# EAGLE design Vanta-Black v4 (EAGLE 9.6.2)
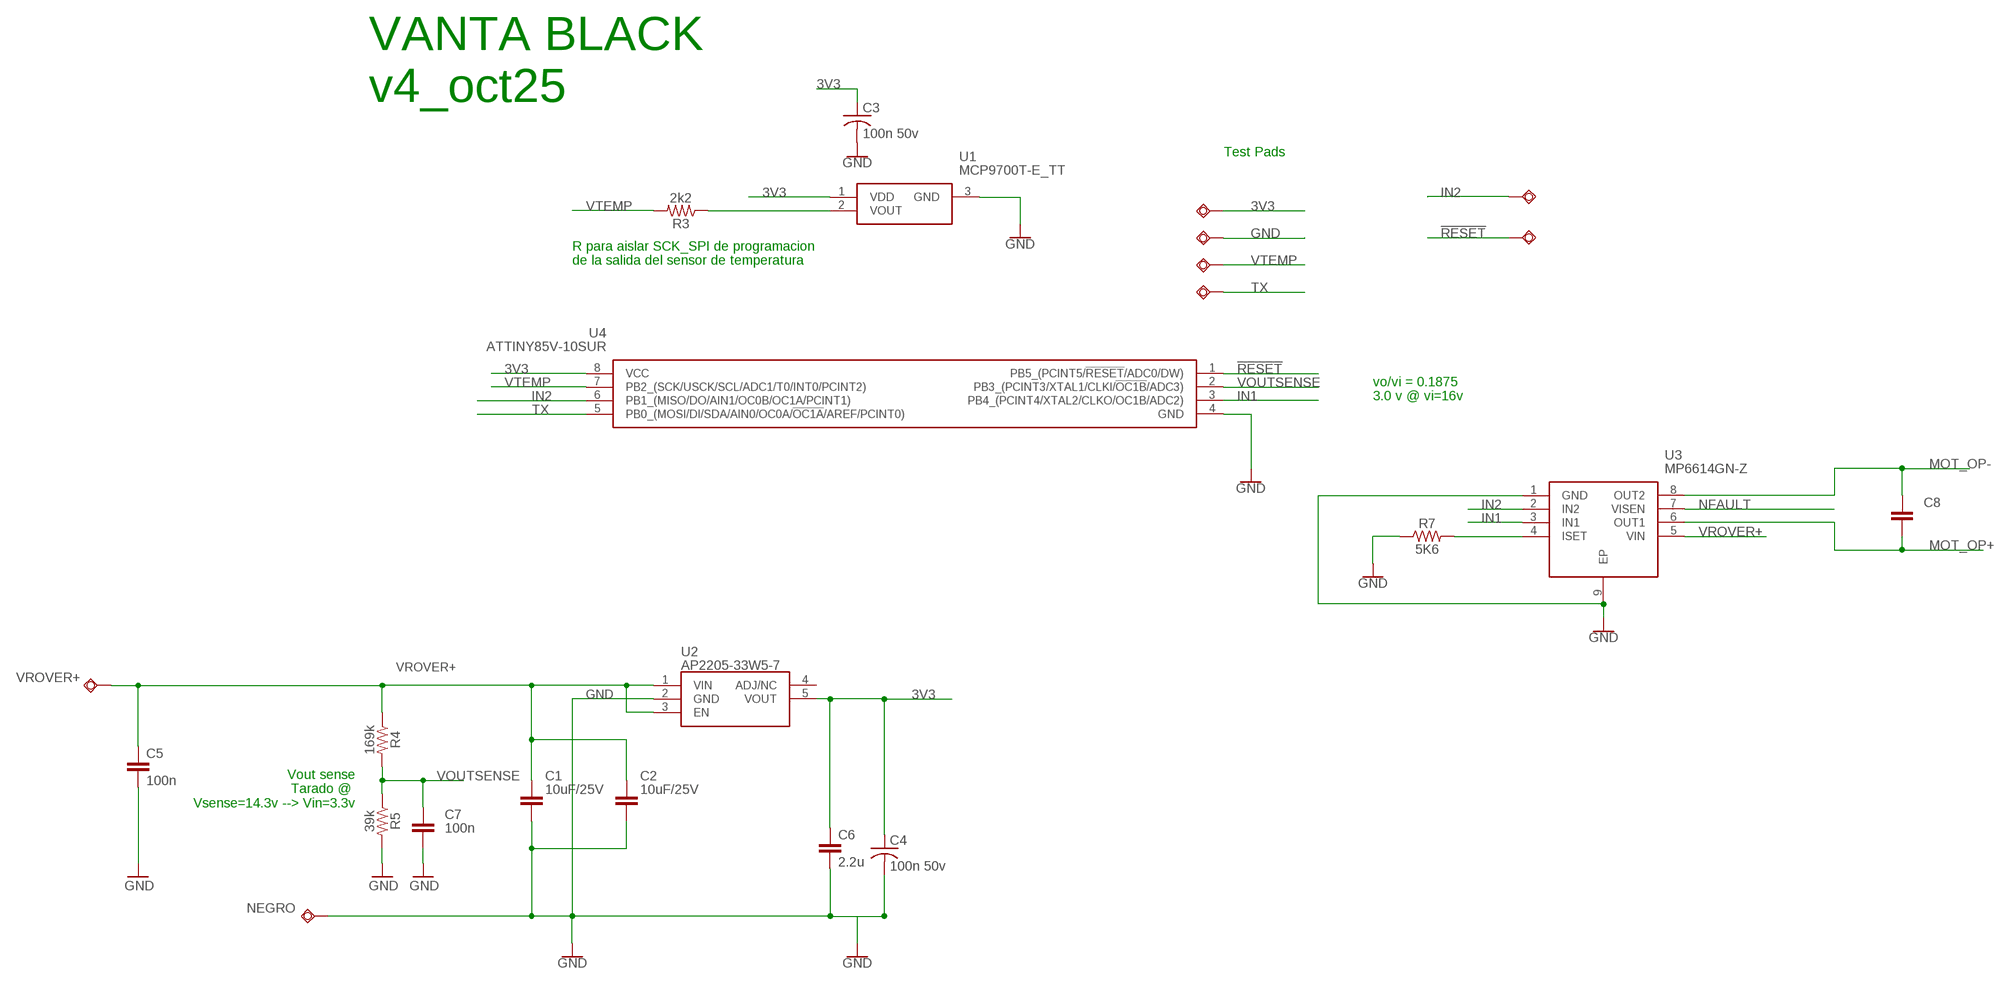
[diagram p0: schematic, sheet 1]

## Parts
3V3  TESTPAD_TPSQB1,27  [TESTPAD_B1,27]
!RST  TESTPAD_TPSQB1,27  [TESTPAD_B1,27]
C1  10uF/25V  C_CHIP-0805(2012-METRIC)  [CAPC2012X110]
C2  10uF/25V  C_CHIP-0805(2012-METRIC)  [CAPC2012X110]
C3  100n 50v  C-USC0805  [C0805]
C4  100n 50v  C-USC0805  [C0805]
C5  100n  4.7UF-6.3V-10%(0603)0603  [0603-CAP]
C6  2.2u  4.7UF-6.3V-10%(0603)0603  [0603-CAP]
C7  100n  0.1UF-0603-25V-(+80/-20%)  [0603]
C8  100n  CAP0805  [0805]
GND  TESTPAD_TPSQB1,27  [TESTPAD_B1,27]
IN2  TESTPAD_TPSQB1,27  [TESTPAD_B1,27]
NEGRO  TESTPAD_TPSQTP10SQ  [TESTPAD_TP10SQ]
R3  2k2  RESISTOR0603  [0603]
R4  169k  RESISTOR0603  [0603]
R5  39k  RESISTOR0603  [0603]
R7  5K6  RESISTOR0603  [0603]
TX  TESTPAD_TPSQB1,27  [TESTPAD_B1,27]
U1  MCP9700T-E_TT  [SOT95P237X112-3N]
U2  AP2205-33W5-7  AP2205-W5-7  [SOT95P282X145-5N]
U3  MP6614GN-Z  [SOIC127P600X170-9N]
U4  ATTINY85V-10SUR  [SOIC127P798X216-8N]
VISEN  TESTPAD_TPSQB1,27  [TESTPAD_B1,27]
VROVER+  TESTPAD_TPSQTP10SQ  [TESTPAD_TP10SQ]

## Nets
3V3: 3V3.TP C3.1 C4.1 C6.1 U1.1(VDD) U2.5(VOUT) U4.8(VCC)
!RESET: !RST.TP U4.1(PB5_(PCINT5/!RESET!/ADC0/DW))
GND: C1.2 C2.2 C3.2 C4.2 C5.2 C6.2 C7.2 GND.TP NEGRO.TP R5.2 R7.1 U1.3(GND) U2.2(GND) U3.1(GND) U3.9(EP) U4.4(GND)
IN1: U3.3(IN1) U4.3(PB4_(PCINT4/XTAL2/CLKO/OC1B/ADC2))
IN2: IN2.TP U3.2(IN2) U4.6(PB1_(MISO/DO/AIN1/OC0B/OC1A/PCINT1))
MOT_OP+: C8.2 U3.6(OUT1)
MOT_OP-: C8.1 U3.8(OUT2)
N$1: R3.1 U1.2(VOUT)
N$2: R7.2 U3.4(ISET)
NFAULT: U3.7(VISEN)
TX: TX.TP U4.5(PB0_(MOSI/DI/SDA/AIN0/OC0A/!OC1A!/AREF/PCINT0))
VOUTSENSE: C7.1 R4.2 R5.1 U4.2(PB3_(PCINT3/XTAL1/CLKI/!OC1B!/ADC3))
VROVER+: C1.1 C2.1 C5.1 R4.1 U2.1(VIN) U2.3(EN) U3.5(VIN) VROVER+.TP
VTEMP: R3.2 U4.7(PB2_(SCK/USCK/SCL/ADC1/T0/INT0/PCINT2)) VISEN.TP
Unconnected: U2.4(ADJ/NC)

## Notes on the sheet
- VANTA BLACK
  v4_oct25
- Test Pads
- R para aislar SCK_SPI de programacion
  de la salida del sensor de temperatura
- vo/vi = 0.1875
  3.0 v @ vi=16v
- Vout sense
  Tarado @ 
  Vsense=14.3v --> Vin=3.3v

## Library data of the parts
3V3 !RST GND IN2 NEGRO TX VISEN VROVER+ = BeagleBone_Blue_R3:TESTPAD_TPSQ: Test pad
C1 C2 = Capacitor:C: Capacitor - Generic; CATEGORY: Capacitor
C3 C4 = adafruit:C-US: CAPACITOR, American symbol
C5 C6 = SparkFun-Capacitors:4.7UF-6.3V-10%(0603): CAP-08280; PROD_ID: CAP-08280; VALUE: 4.7uF
C7 = SparkFun-Capacitors:0.1UF: 0.1µF ceramic capacitors A capacitor is a passive two-terminal electrical component used to store electrical energy temporarily in an electric field.; PROD_ID: CAP-00810; VALUE: 0.1uF
C8 = SparkFun-Passives:CAP: Capacitor Standard 0603 ceramic capacitor, and 0.1" leaded capacitor.
R3-R5 R7 = SparkFun-Resistors:RESISTOR: Generic Resistor Package
U1 = SamacSys_Parts:MCP9700T-E_TT: Linear Active Thermistor 10mV/C SOT23 Source: Datasheet <https://datasheet.datasheetarchive.com/originals/distributors/Datasheets-DGA2/179941.pdf>; ARROW_PART_NUMBER: MCP9700T-E/TT; ARROW_PRICE-STOCK: https://www.arrow.com/en/products/mcp9700t-ett/microchip-technology?utm_currency=USD&region=nac; DESCRIPTION: Linear Active Thermistor 10mV/C SOT23; HEIGHT: 1.12mm; MANUFACTURER_NAME: Microchip; MANUFACTURER_PART_NUMBER: MCP9700T-E/TT; MOUSER_PART_NUMBER: 579-MCP9700T-E/TT; MOUSER_PRICE-STOCK: https://www.mouser.co.uk/ProductDetail/Microchip-Technology/MCP9700T-E-TT?qs=QVBMgXxBiLyzQ04uBGj3mg%3D%3D
U2 = AP2205-W5-7:AP2205-W5-7: LDO Voltage Regulators LDO CMOS LowCurr Source: Datasheet <https://www.diodes.com/assets/Datasheets/AP2206.pdf>; DESCRIPTION: LDO Voltage Regulators LDO CMOS LowCurr; HEIGHT: 1.45mm; MANUFACTURER_NAME: Diodes Inc.; MANUFACTURER_PART_NUMBER: AP2205-W5-7; MOUSER_PART_NUMBER: 621-AP2205-W5-7; MOUSER_PRICE-STOCK: https://www.mouser.com/Search/Refine.aspx?Keyword=621-AP2205-W5-7
U3 = SamacSys_Parts:MP6614GN-Z: Motor/Motion/Ignition Controllers & Drivers 35V, H-Bridge DC Motor Driver in an SOIC-8EP Package Source: Datasheet <https://www.mouser.com/datasheet/2/277/MP6614GN-3364211.pdf>; DESCRIPTION: Motor/Motion/Ignition Controllers & Drivers 35V, H-Bridge DC Motor Driver in an SOIC-8EP Package; HEIGHT: 1.7mm; MANUFACTURER_NAME: Monolithic Power Systems (MPS); MANUFACTURER_PART_NUMBER: MP6614GN-Z; MOUSER_PART_NUMBER: 946-MP6614GN-Z; MOUSER_PRICE-STOCK: https://www.mouser.co.uk/ProductDetail/Monolithic-Power-Systems-MPS/MP6614GN-Z?qs=1Kr7Jg1SGW9IVALEk2ju9A%3D%3D
U4 = SamacSys_Parts:ATTINY85V-10SUR: MICROCHIP - ATTINY85V-10SUR - MCU, 8BIT, AVR, 10MHZ, WSOIC-8 Source: Datasheet <https://componentsearchengine.com/Datasheets/2/ATTINY85V-10SUR.pdf>; DESCRIPTION: MICROCHIP - ATTINY85V-10SUR - MCU, 8BIT, AVR, 10MHZ, WSOIC-8; FARNELL2_PART_NUMBER: 2851618RL; FARNELL2_PRICE-STOCK: http://uk.farnell.com/jsp/displayProduct.jsp?sku=2851618RL&action=view; HEIGHT: 2.16mm; MANUFACTURER_NAME: Microchip; MANUFACTURER_PART_NUMBER: ATTINY85V-10SUR

## Board
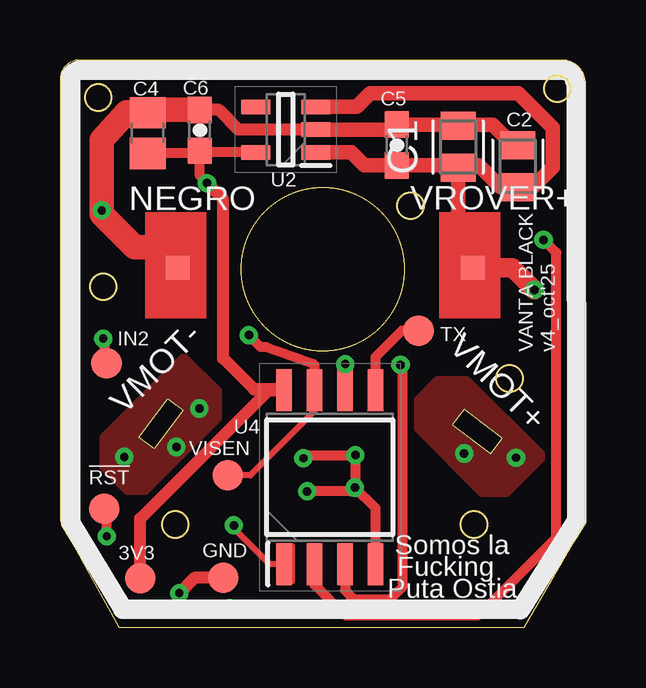
[diagram p1: board, top side]
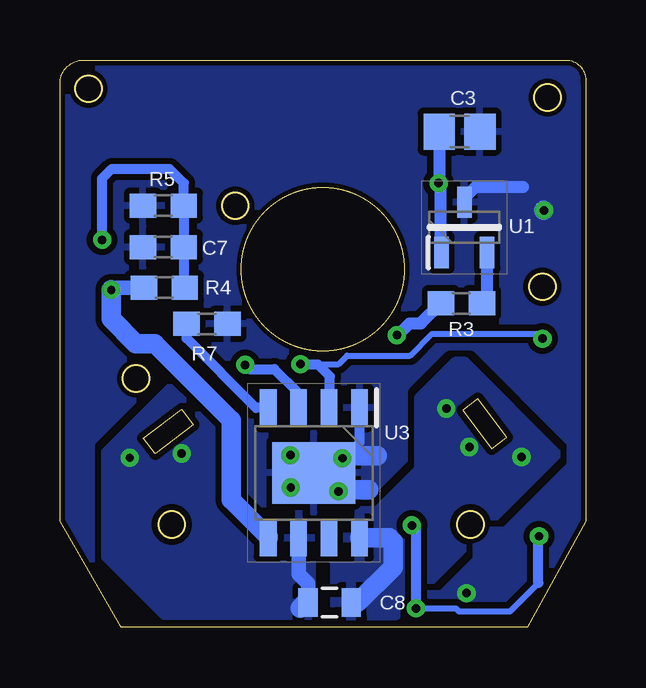
[diagram p2: board, bottom side, seen from below]

Size 21.9 x 23.63 mm. Coordinates in mm from the lower left corner, seen from the top.
Outline: 16.83,9.07 16.35,8.43 17.94,7.22 18.43,7.86 16.83,9.07
Outline: 5.13,9.03 3.92,7.44 3.29,7.92 4.5,9.52 5.13,9.03
Outline: 21.9,22.72 arc90 20.84,23.63 0.74,23.63 arc90 0,22.72 0,4.42 2.44,0 19.35,0 21.9,4.42 21.9,22.72
Outline: circle at 10.95,14.91 radius 3.4
Outline: circle at 4.8,4.28 radius 0.55
Outline: circle at 17.25,4.28 radius 0.55
Outline: circle at 1.8,14.19 radius 0.55
Outline: circle at 18.73,10.36 radius 0.55
Outline: circle at 14.61,17.56 radius 0.55
Outline: circle at 1.59,22.07 radius 0.55
Outline: circle at 20.71,22.43 radius 0.55
Copper layers (1*16): Top 0.035mm / dielectric 1.5mm / Bottom 0.035mm
Design rules "default *": minimum track width 6mil, minimum drill 0.35mm, track to track 10mil, track to pad 10mil, pad to pad 10mil, via to via 10mil, smd to smd 0mil, copper to edge 1mil, drill to drill 6mil, minimum pad ring 10mil, minimum via ring 8mil, stop-mask expansion 4mil, vias tented up to drill 0mil, thermal gap 10mil
vRestrict: area 95.1,61.7 to 95.7,63

### Footprints (pad centres in the part's own frame; a part is rotated, then mirrored left to right if it is on the bottom)
TESTPAD_B1,27 = smd 1.27 x 1.27: TP 0,0
CAPC2012X110 = smd 1.165 x 1.465: 1 -0.875,0; 2 0.875,0
C0805 = smd 1.3 x 1.5: 1 -0.85,0; 2 0.85,0
0603-CAP = smd 1.1 x 1: 1 -0.85,0; 2 0.85,0
0603 = smd 1.1 x 1: 1 -0.85,0; 2 0.85,0
0805 = smd 0.8 x 1.2: 1 -0.9,0; 2 0.9,0
TESTPAD_TP10SQ = smd 1 x 1: TP 0,0
SOT95P237X112-3N = smd 1.3 x 0.6: 1 -1.05,0.95; 2 -1.05,-0.95; 3 1.05,0
SOT95P282X145-5N = smd 1.2 x 0.6: 1 -1.25,0.95; 2 -1.25,0; 3 -1.25,-0.95; 4 1.25,-0.95; 5 1.25,0.95
SOIC127P600X170-9N = smd 1.525 x 0.7: 1 -2.712,1.905; 2 -2.712,0.635; 3 -2.712,-0.635; 4 -2.712,-1.905; 5 2.712,-1.905; 6 2.712,-0.635; 7 2.712,0.635; 8 2.712,1.905 | smd 2.56 x 3.45: 9 0,0
SOIC127P798X216-8N = smd 1.75 x 0.65: 1 -3.625,1.905; 2 -3.625,0.635; 3 -3.625,-0.635; 4 -3.625,-1.905; 5 3.625,-1.905; 6 3.625,-0.635; 7 3.625,0.635; 8 3.625,1.905

### Placement (x,y rotation side)
3V3  3.34,2.03 0 top
!RST  1.84,4.93 0 top
C1  16.59,20.01 90 top
C2  19.08,19.2 90 top
C3  5.26,20.65 0 bottom
C4  3.65,20.59 90 top
C5  14.04,20.09 90 top
C6  5.83,20.7 90 top
C7  17.6,15.84 180 bottom
C8  10.67,1.03 180 bottom
GND  6.79,2.05 0 top
IN2  1.94,11 0 top
NEGRO  4.91,14.99 0 top
R3  5.18,13.5 180 bottom
R4  17.56,14.14 0 bottom
R5  17.6,17.57 180 bottom
R7  15.78,12.64 180 bottom
TX  14.94,12.36 0 top
U1  5.06,16.66 90 bottom
U2  9.41,20.73 180 top
U3  11.33,6.43 270 bottom
U4  11.24,6.25 90 top
VISEN  7,6.33 0 top
VROVER+  17.19,14.99 0 top

### Tracks (layer width: path | path; a pad name or v marks a point on that pad's centre or on a via)
3V3  (via drill 0.35)
  Top 0.406: U2.5 5.9,19.78 C6.1 | C6.1 5.72,19.74 C4.1 | v6.13,18.5 5.83,18.8 C6.1
  Top 0.508: v6.13,18.5 6.8,17.83 6.8,11.2 8.09,9.91 9.31,9.91 U4.8 9.31,9.85 8.67,9.85 3.34,4.52 3V3.TP
  Bottom 0.508: U1.1 6.07,15.67 6.07,18.44 v6.13,18.5 6.11,18.52 C3.1
!RESET  (via drill 0.35)
  Top 0.254: 9.67,3.38 9.67,1.9 9.62,1.95 9.34,1.95 U4.1 8.74,2.63 7.24,4.12 v7.24,4.25 | 1.95,4.82 !RST.TP
  Top 0.406: v1.95,3.79 1.95,4.82
  Bottom 0.254: v7.24,4.25 7.07,4.07 | v7.07,0.78 5.41,0.78 5.28,0.66 3.15,0.66 1.97,1.84 | 1.97,3.79 v1.95,3.79
  Bottom 0.406: 7.07,4.07 v7.07,0.78 | 1.97,1.84 1.97,3.79
GND  (via drill 0.35)
  Top 0.406: U4.4 13.15,4.96 v12.29,5.82 | v12.29,5.82 12.13,5.66 v10.3,5.66 | v10.14,7.04 10.27,7.17 v12.31,7.17 12.31,5.84 v12.29,5.82
  Top 0.508: U2.2 7.45,20.73 6.63,21.55 C6.2 | GND.TP 5.6,2.05 v4.97,1.42 | C5.2
  Top 0.61: U2.2 14.04,20.72 14.14,20.82 14.14,20.84 C5.2 16.53,20.94 | 16.53,20.94 C1.2 | C2.2 18.89,20.08 18.03,20.94 16.53,20.94
  Top 1.016: 4.1,15.8 NEGRO.TP 4.05,15.84 3.11,15.84 1.74,17.21 v1.74,17.37 1.74,20.32 2.77,21.46 3.63,21.46 C4.2 3.76,21.55 C6.2
  Bottom 0.406: U3.1 9.42,7.7 10.69,6.43 U3.9 11.68,6.43 v12.29,5.82
  Bottom 0.508: U1.3 5.06,17.88 4.59,18.35 2.61,18.35
  Bottom 0.813: v1.74,17.37 v1.75,17.36 | 8.68,7.14 10.62,7.14 U3.9 10.63,5.73 9.04,5.73
  pour Bottom (isolate 0.2, rank 2): 0.05,24.1 21.55,24.1 22.65,23 22.65,2.05 18.81,-1.79 2.22,-1.79 -0.6,1.03 -0.6,23.45
IN1  (via drill 0.35)
  Top 0.406: U4.3 11.88,1.53 12.25,1.16 13.76,1.16 14.25,1.66 14.25,10.87 v14.19,10.93
  Bottom 0.406: U3.3 11.96,9.75 12.97,10.75 14.02,10.75 v14.19,10.92 v14.19,10.93
IN2  (via drill 0.35)
  Top 0.254: v1.8,12.03 1.84,11.99 | 1.84,11.1 IN2.TP
  Top 0.305: v11.89,10.96 v11.88,10.95 U4.6
  Top 0.406: 1.84,11.99 1.84,11.1
  Bottom 0.254: v11.89,10.96 10.29,10.96 9.94,11.31 7.32,11.31 6.41,12.22 2.06,12.22 1.86,12.03 v1.8,12.03
  Bottom 0.406: U3.2 10.66,9.18 10.66,10.45 11.16,10.95 11.88,10.95 v11.89,10.96
MOT_OP+  (via drill 0.35)
  Bottom 0.61: U3.6 11.96,2.22 11.57,1.82 C8.2
  Bottom 0.813: 11.9,0.79 11.66,1.03 C8.2
  other vias: 16.84,7.24 19,7.06
  pour Top: 14.88,9.46 15.73,10.31 16.96,10.31 20.15,7.12 18.62,5.59 17.58,5.59 14.88,8.29
  pour Bottom (isolate 0.254): 11.4,8.18 13.52,10.3 17.04,10.3 20.04,7.3 20.04,2.91 17.58,0.45 11.4,0.45
MOT_OP-  (via drill 0.35)
  Bottom 0.813: C8.1 9.49,1.03 8.03,2.49 8.03,3.56 8.19,3.72 U3.8
  other vias: 2.68,7.09 5.81,9.11 4.85,7.51
  pour Top: 2.8,5.66 1.8,6.66 1.8,7.91 5.16,11.28 6.59,9.85 6.59,8.7 3.55,5.66
  pour Bottom (isolate 0.254): 5.45,11.05 6.95,9.55 6.95,6.58 8.7,4.83 9.61,4.83 10.46,3.98 10.46,0.5 7.89,0.5 1.18,7.21 5.02,11.05
N$1
  Bottom 0.508: U1.2 4.12,13.71 R3.1
N$2
  Bottom 0.406: U3.4 13.74,9.14 16.63,12.03 R7.2
TX
  Top 0.406: TX.TP 14.24,12.36 13.15,11.27 U4.5
VOUTSENSE  (via drill 0.35)
  Top 0.406: U4.2 10.61,1.76 11.87,0.5 17.45,0.5 20.68,3.73 20.68,15.61 v20.15,16.14
  Bottom 0.406: v20.15,16.14 20.15,18.7 19.75,19.1 17.35,19.1 16.75,18.5 R5.1 C7.1 16.75,14.18 R4.2
VROVER+  (via drill 0.35)
  Top 0.61: VROVER+.TP 16.59,15.59 C1.1 | U2.3 12.36,21.68 12.93,22.25 19.1,22.25 20.54,20.81 20.54,19.17 19.69,18.33 C2.1 18.37,18.33 17.46,19.24 16.69,19.24 C1.1 | U2.1 12.13,19.78 12.67,19.24 C5.1 16.48,19.24 C1.1
  Top 0.813: VROVER+.TP 18.84,14.99 v19.77,14.06
  Bottom 0.61: R4.1 19.69,14.14 v19.77,14.06
  Bottom 0.813: U3.5 13.23,3.77 14.78,5.31 14.78,8.62 17.97,11.81 18.74,11.81 19.77,12.84 v19.77,14.06
VTEMP  (via drill 0.35)
  Top 0.254: U4.7 10.61,9.01 7.93,6.33 VISEN.TP
  Top 0.406: U4.7 10.61,10.92 10.57,10.96 8.58,11.67 8.37,11.67 v7.87,12.17
  Bottom 0.508: v7.87,12.17 7.83,12.17 7.34,12.66 6.87,12.66 R3.2
(copper drawn outside any net)
  shapes: Top area x2

### Text on the board
tPlace: VANTA BLACK / v4_oct'25 | VMOT- | VMOT+ | Puta Ostia
tNames: Somos la | Fucking